# EAGLE schematic Schema_IOExp_De_Windt_Kyell (EAGLE 9.6.2)
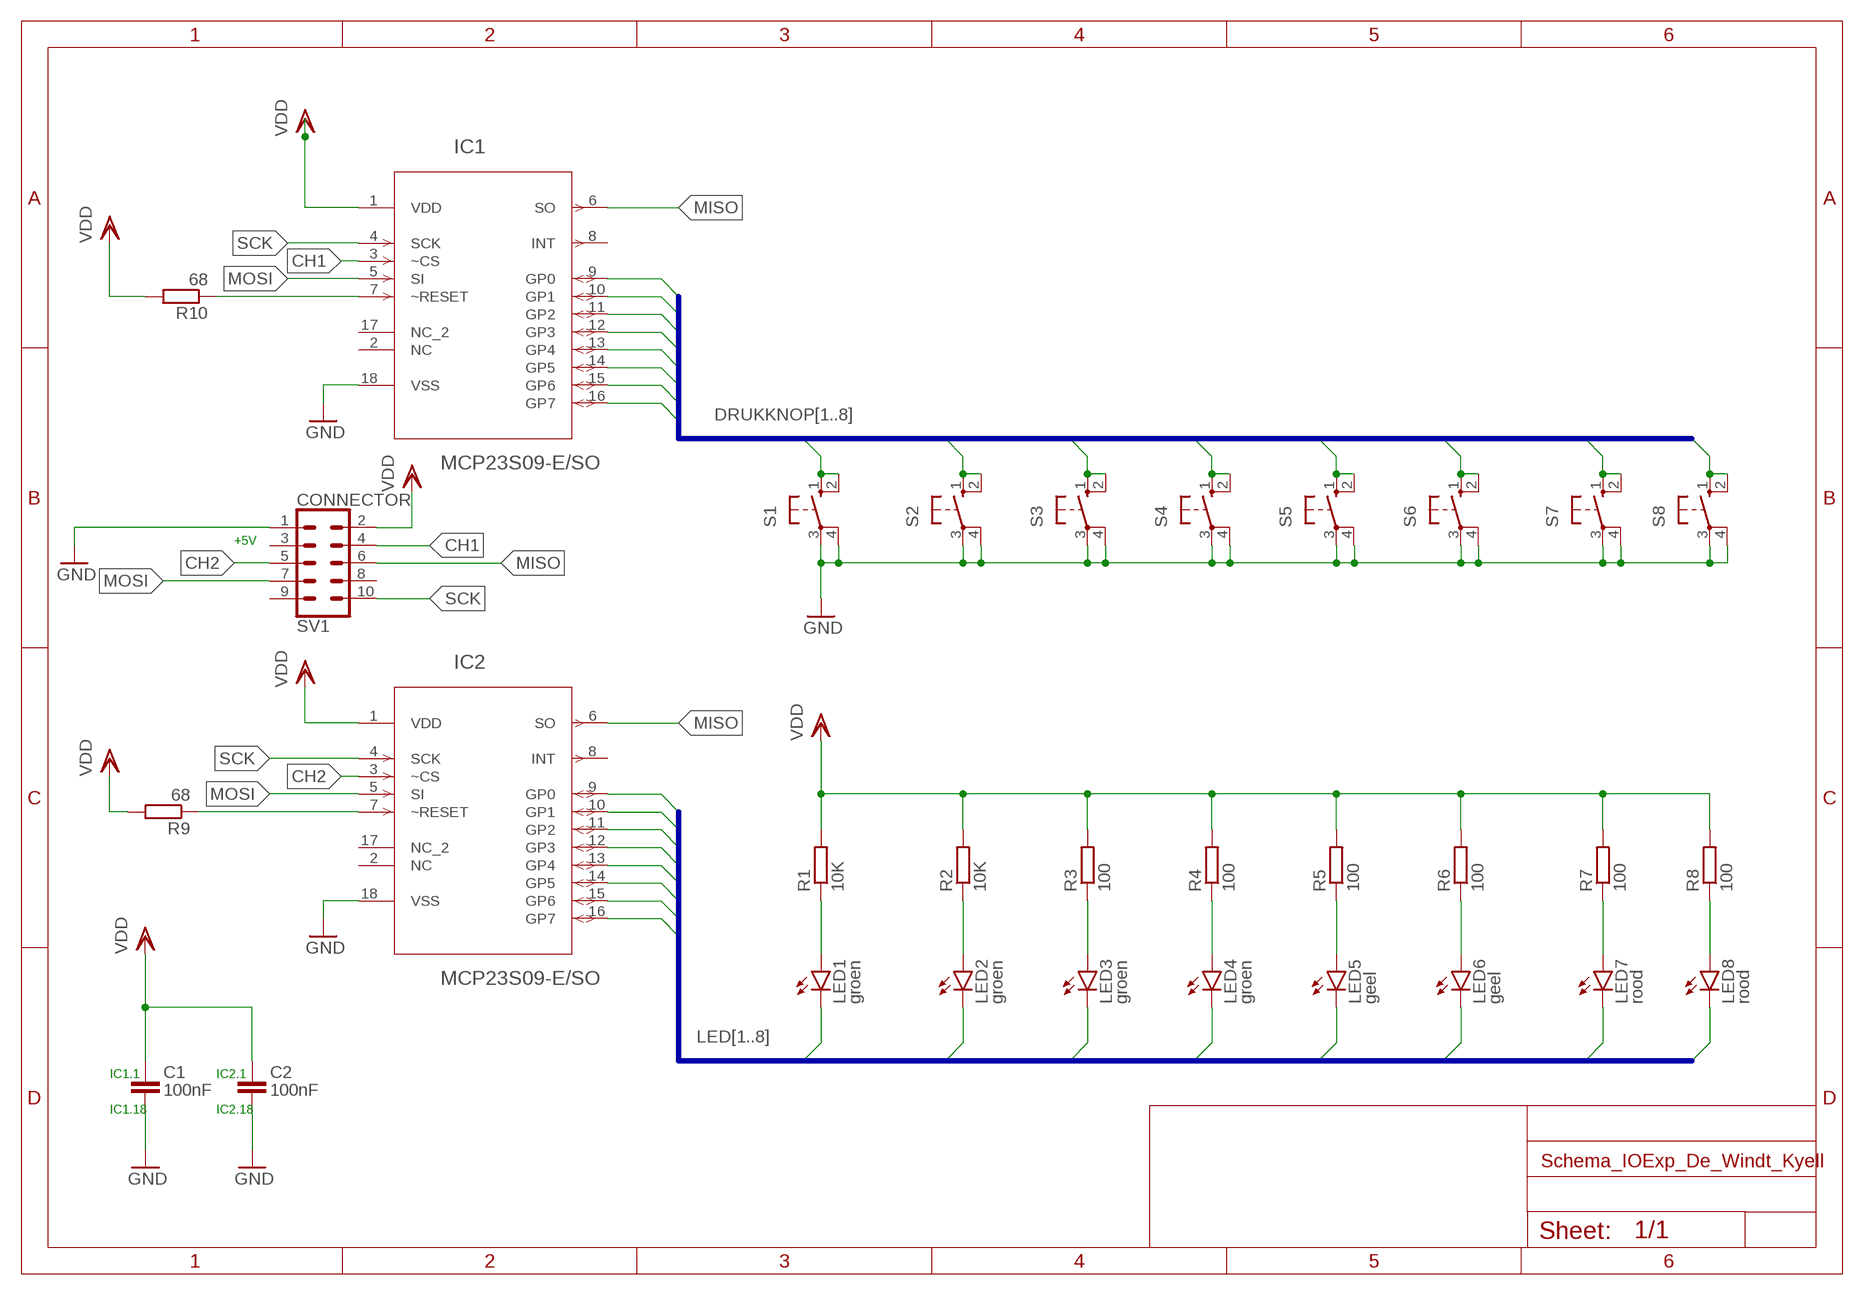
[diagram p0: schematic, sheet 1]

## Parts
C1  100nF  CAPACITORC0805K  [C0805K]
C2  100nF  CAPACITORC0805K  [C0805K]
CONNECTOR  SV1  CONN_05X2SHD  [2X5-SHROUDED]
IC1  MCP23S09-E/SO  [SOIC127P1030X265-18N]
IC2  MCP23S09-E/SO  [SOIC127P1030X265-18N]
LED1  groen  LEDCHIPLED_0805  [CHIPLED_0805]
LED2  groen  LEDCHIPLED_0805  [CHIPLED_0805]
LED3  groen  LEDCHIPLED_0805  [CHIPLED_0805]
LED4  groen  LEDCHIPLED_0805  [CHIPLED_0805]
LED5  geel  LEDCHIPLED_0805  [CHIPLED_0805]
LED6  geel  LEDCHIPLED_0805  [CHIPLED_0805]
LED7  rood  LEDCHIPLED_0805  [CHIPLED_0805]
LED8  rood  LEDCHIPLED_0805  [CHIPLED_0805]
R1  10K  R-EU_R0805  [R0805]
R2  10K  R-EU_R0805  [R0805]
R3  100  R-EU_R0805  [R0805]
R4  100  R-EU_R0805  [R0805]
R5  100  R-EU_R0805  [R0805]
R6  100  R-EU_R0805  [R0805]
R7  100  R-EU_R0805  [R0805]
R8  100  R-EU_R0805  [R0805]
R9  68  R-EU_R0805  [R0805]
R10  68  R-EU_R0805  [R0805]
S1  10-XX  [B3F-10XX]
S2  10-XX  [B3F-10XX]
S3  10-XX  [B3F-10XX]
S4  10-XX  [B3F-10XX]
S5  10-XX  [B3F-10XX]
S6  10-XX  [B3F-10XX]
S7  10-XX  [B3F-10XX]
S8  10-XX  [B3F-10XX]

## Nets
CH1: CONNECTOR.4 IC1.3(~CS)
CH2: CONNECTOR.5 IC2.3(~CS)
DRUKKNOP1: IC1.9(GP0) S1.1(S) S1.2(S1)
DRUKKNOP2: IC1.10(GP1) S2.1(S) S2.2(S1)
DRUKKNOP3: IC1.11(GP2) S3.1(S) S3.2(S1)
DRUKKNOP4: IC1.12(GP3) S4.1(S) S4.2(S1)
DRUKKNOP5: IC1.13(GP4) S5.1(S) S5.2(S1)
DRUKKNOP6: IC1.14(GP5) S6.1(S) S6.2(S1)
DRUKKNOP7: IC1.15(GP6) S7.1(S) S7.2(S1)
DRUKKNOP8: IC1.16(GP7) S8.1(S) S8.2(S1)
GND: C1.2 C2.2 CONNECTOR.1 IC1.18(VSS) IC2.18(VSS) S1.3(P) S1.4(P1) S2.3(P) S2.4(P1) S3.3(P) S3.4(P1) S4.3(P) S4.4(P1) S5.3(P) S5.4(P1) S6.3(P) S6.4(P1) S7.3(P) S7.4(P1) S8.3(P) S8.4(P1)
LED1: IC2.9(GP0) LED1.C
LED2: IC2.10(GP1) LED2.C
LED3: IC2.11(GP2) LED3.C
LED4: IC2.12(GP3) LED4.C
LED5: IC2.13(GP4) LED5.C
LED6: IC2.14(GP5) LED6.C
LED7: IC2.15(GP6) LED7.C
LED8: IC2.16(GP7) LED8.C
MISO: CONNECTOR.6 IC1.6(SO) IC2.6(SO)
MOSI: CONNECTOR.7 IC1.5(SI) IC2.5(SI)
N$3: LED8.A R8.1
N$4: LED7.A R7.1
N$5: LED6.A R6.1
N$6: LED5.A R5.1
N$7: LED4.A R4.1
N$8: LED3.A R3.1
N$9: LED2.A R2.1
N$10: LED1.A R1.1
N$12: IC2.7(~RESET) R9.1
N$13: IC1.7(~RESET) R10.1
SCK: CONNECTOR.10 IC1.4(SCK) IC2.4(SCK)
VDD: C1.1 C2.1 CONNECTOR.2 IC1.1(VDD) IC2.1(VDD) R1.2 R2.2 R3.2 R4.2 R5.2 R6.2 R7.2 R8.2 R9.2 R10.2
Unconnected: CONNECTOR.3 CONNECTOR.8 CONNECTOR.9 IC1.2(NC) IC1.8(INT) IC1.17(NC_2) IC2.2(NC) IC2.8(INT) IC2.17(NC_2)

## Buses
DRUKKNOP[1..8]
LED[1..8]

## Notes on the sheet
- +5V
- IC1.1 | IC2.1
- IC1.18 | IC2.18

## Library data of the parts
C1 C2 = Fidget_Spinner:CAPACITOR: CAPACITOR, European symbol; SPICEPREFIX: C
CONNECTOR = SparkFun-Connectors:CONN_05X2: Multi connection point. Often used as Generic Header-pin footprint for 0.1 inch spaced/style header connections For AVR SPI programming port, see special device with nice symbol: "AVR_SPI_PROG_5x2.dev" You can populate with any combo of single row headers, but if you'd like an exact match, check these: 2x5 AVR ICSP Male Header <https://www.sparkfun.com/products/778> (PRT-00778) 2x5 Pin Shrouded Header <https://www.sparkfun.com/products/8506> (PRT-08506) On any of the 0.1 inch spaced packages, you can populate with these: Break Away Headers - Straight <https://www.sparkfun.com/products/116> (PRT-00116) Break Away Male Headers - Right Angle <https://www.sparkfun.com/products/553> (PRT-00553) Female Headers <https://www.sparkfun.com/products/115> (PRT-00115) Break Away Headers - Machine Pin <https://www.sparkfun.com/products/117> (PRT-00117) Break Away Female Headers - Swiss Machine Pin <https://www.sparkfun.com/products/743> (PRT-00743) Special note: the shrouded connector mates well with our 5x2 ribbon cables: 2x5 Pin IDC Ribbon Cable <https://www.sparkfun.com/products/8535> (PRT-08535); PROD_ID: CONN-08671; SF_ID: PRT-08506
IC1 IC2 = MCP23S09_E_SO:MCP23S09-E/SO: 8-Bit I/O Expander; DESCRIPTION: IC I/O EXPANDER; MPN: McP23S09-E/SO; OC_FARNELL: 1699844; OC_NEWARK: 04R7657; PACKAGE: SOIC-18; SUPPLIER: Microchip
LED1-LED8 = led:LED: LED OSRAM: - CHIPLED LG R971, LG N971, LY N971, LG Q971, LY Q971, LO R971, LY R971 LH N974, LH R974 LS Q976, LO Q976, LY Q976 LO Q996 - Hyper CHIPLED LW Q18S LB Q993, LB Q99A, LB R99A - SideLED LS A670, LO A670, LY A670, LG A670, LP A670 LB A673, LV A673, LT A673, LW A673 LH A674 LY A675 LS A676, LA A676, LO A676, LY A676, LW A676 LS A679, LY A679, LG A679 - Hyper Micro SIDELED® LS Y876, LA Y876, LO Y876, LY Y876 LT Y87S - SmartLED LW L88C, LW L88S LB L89C, LB L89S, LG L890 LS L89K, LO L89K, LY L89K LS L896, LA L896, LO L896, LY L896 - TOPLED LS T670, LO T670, LY T670, LG T670, LP T670 LSG T670, LSP T670, LSY T670, LOP T670, LYG T670 LG T671, LOG T671, LSG T671 LB T673, LV T673, LT T673, LW T673 LH T674 LS T676, LA T676, LO T676, LY T676, LB T676, LH T676, LSB T676, LW T676 LB T67C, LV T67C, LT T67C, LS T67K, LO T67K, LY T67K, LW E67C LS E67B, LA E67B, LO E67B, LY E67B, LB E67C, LV E67C, LT E67C LW T67C LS T679, LY T679, LG T679 LS T770, LO T770, LY T770, LG T770, LP T770 LB T773, LV T773, LT T773, LW T773 LH T774 LS E675, LA E675, LY E675, LS T675 LS T776, LA T776, LO T776, LY T776, LB T776 LHGB T686 LT T68C, LB T68C - Hyper Mini TOPLED® LB M676 - Mini TOPLED Santana® LG M470 LS M47K, LO M47K, LY M47K Source: http://www.osram.convergy.de LUXEON: - LUMILED® LXK2-PW12-R00, LXK2-PW12-S00, LXK2-PW14-U00, LXK2-PW14-V00 LXK2-PM12-R00, LXK2-PM12-S00, LXK2-PM14-U00 LXK2-PE12-Q00, LXK2-PE12-R00, LXK2-PE12-S00, LXK2-PE14-T00, LXK2-PE14-U00 LXK2-PB12-K00, LXK2-PB12-L00, LXK2-PB12-M00, LXK2-PB14-N00, LXK2-PB14-P00, LXK2-PB14-Q00 LXK2-PR12-L00, LXK2-PR12-M00, LXK2-PR14-Q00, LXK2-PR14-R00 LXK2-PD12-Q00, LXK2-PD12-R00, LXK2-PD12-S00 LXK2-PH12-R00, LXK2-PH12-S00 LXK2-PL12-P00, LXK2-PL12-Q00, LXK2-PL12-R00 Source: www.luxeon.com KINGBRIGHT: KA-3528ASYC Source: www.kingbright.com
R1-R10 = rcl:R-EU_: RESISTOR, European symbol; SPICEPREFIX: R
S1-S8 = switch-omron:10-XX: OMRON SWITCH; MPN: B3F-1000; OC_FARNELL: 176432; OC_NEWARK: 36M3542